# EAGLE design mericiObvod (EAGLE 7.2.0)
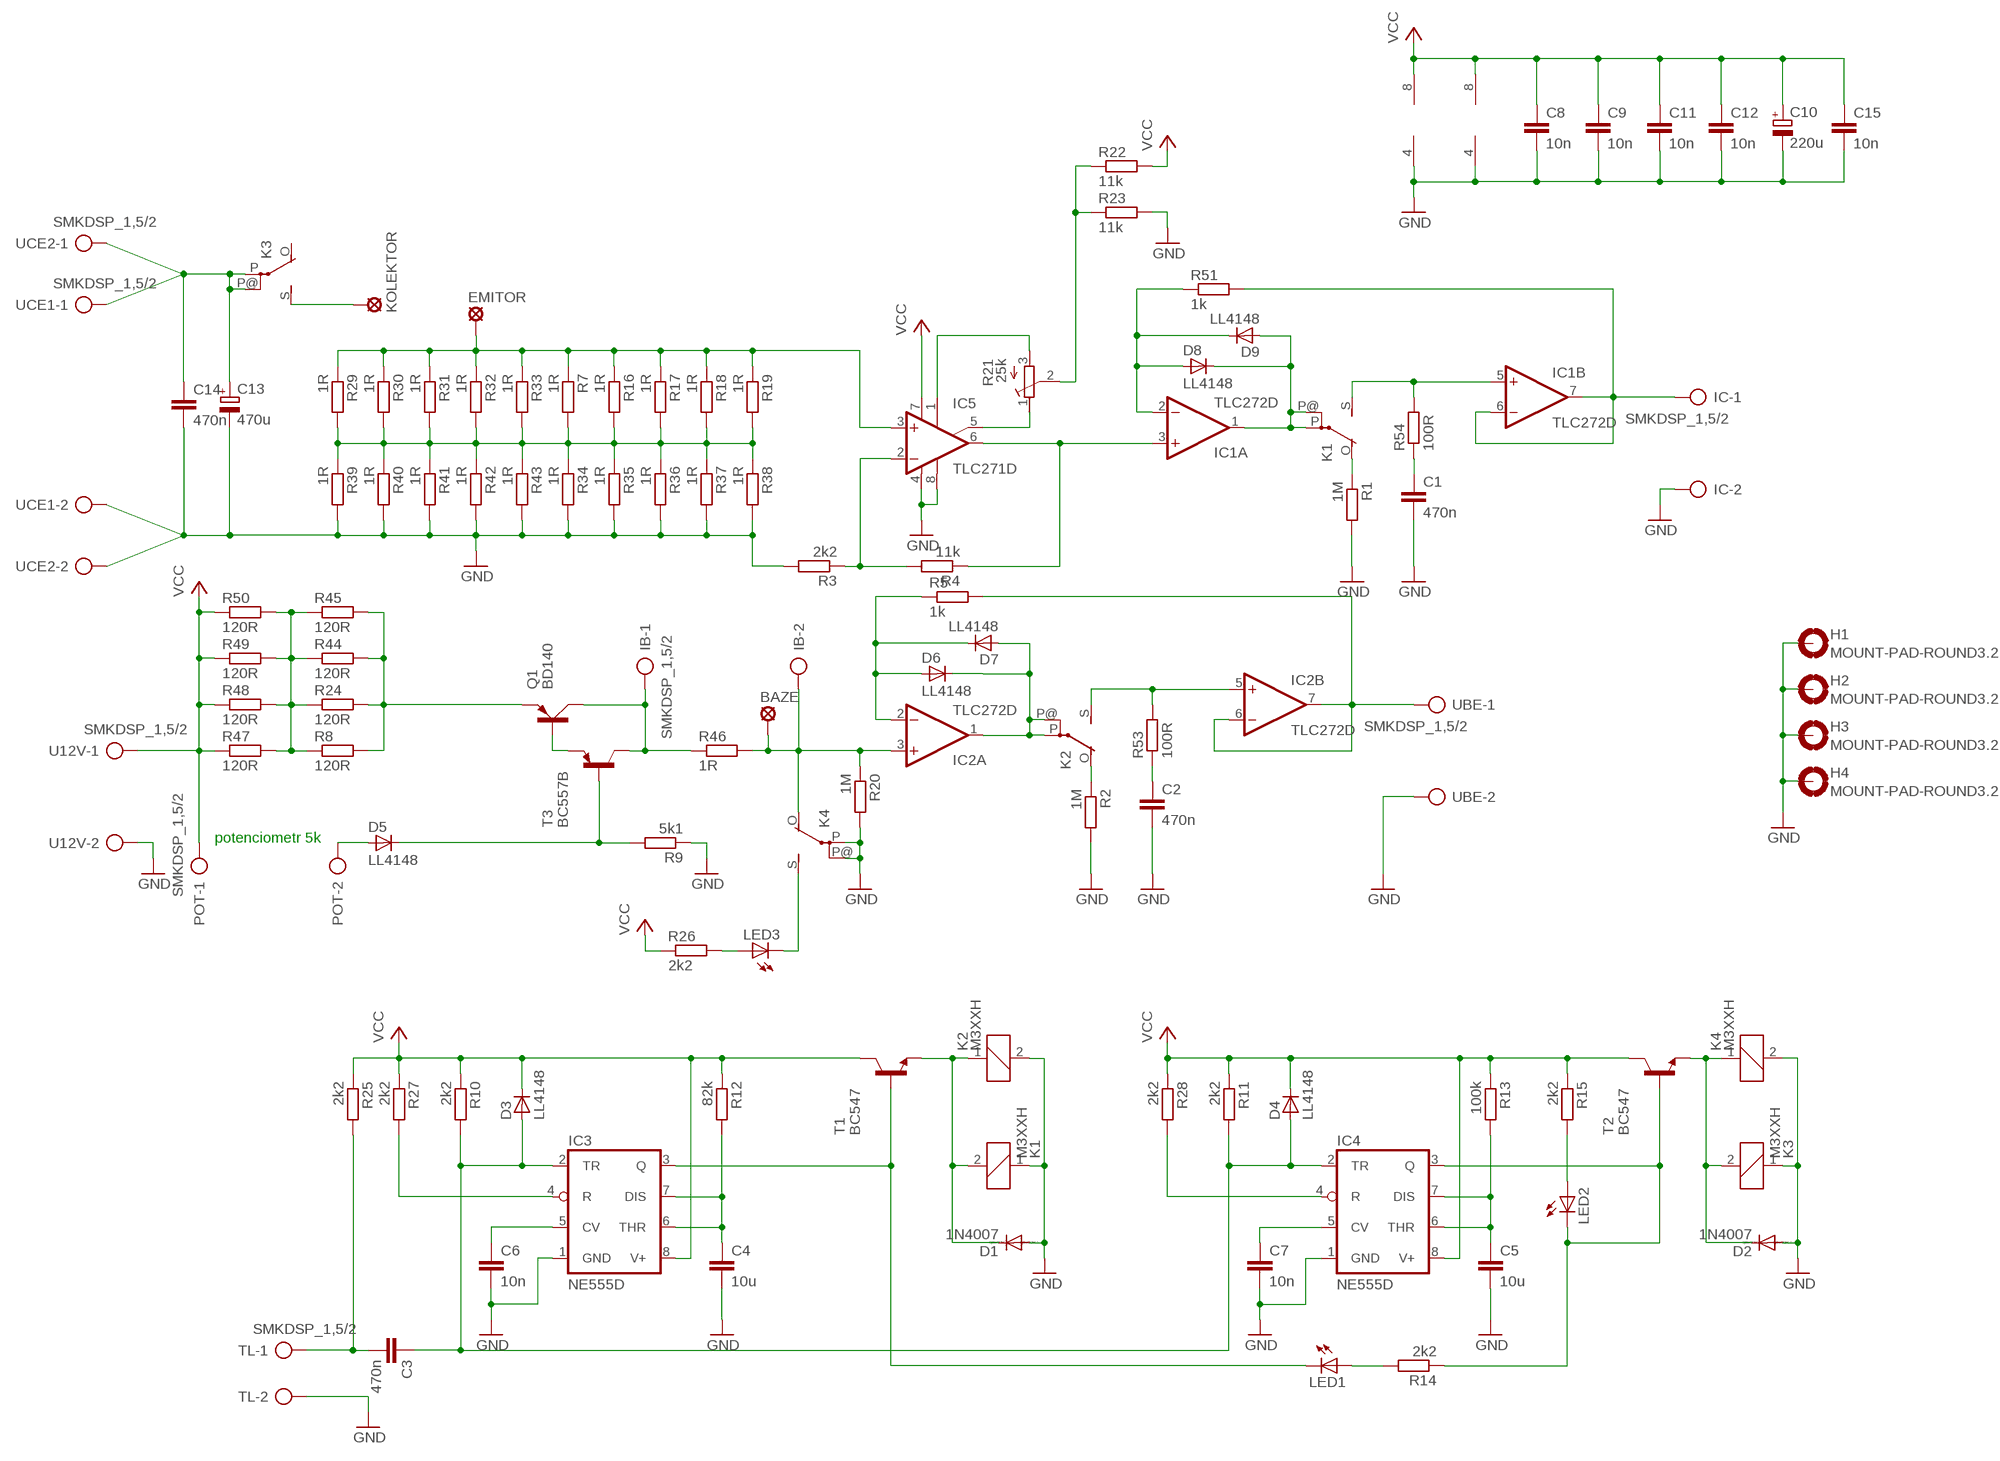
[diagram p0: schematic, sheet 1]

## Parts
BAZE  SE13  [SE13]
C1  470n  C-EUC0805K  [C0805K]
C2  470n  C-EUC0805K  [C0805K]
C3  470n  C-EUC0805K  [C0805K]
C4  10u  C-EUC0805K  [C0805K]
C5  10u  C-EUC0805K  [C0805K]
C6  10n  C-EUC0805K  [C0805K]
C7  10n  C-EUC0805K  [C0805K]
C8  10n  C-EUC0805K  [C0805K]
C9  10n  C-EUC0805K  [C0805K]
C10  220u  CPOL-EUE5-8.5  [E5-8,5]
C11  10n  C-EUC0805K  [C0805K]
C12  10n  C-EUC0805K  [C0805K]
C13  470u  CPOL-EUE5-8.5  [E5-8,5]
C14  470n  C-EU050-030X075  [C050-030X075]
C15  10n  C-EUC0805K  [C0805K]
D1  1N4007  DIODE-DO41-10  [DO41-10]
D2  1N4007  DIODE-DO41-10  [DO41-10]
D3  LL4148  D-SOD-80  [SOD80]
D4  LL4148  D-SOD-80  [SOD80]
D5  LL4148  D-SOD-80  [SOD80]
D6  LL4148  D-SOD-80  [SOD80]
D7  LL4148  D-SOD-80  [SOD80]
D8  LL4148  D-SOD-80  [SOD80]
D9  LL4148  D-SOD-80  [SOD80]
EMITOR  SE13  [SE13]
H1  MOUNT-PAD-ROUND3.2  [3,2-PAD]
H2  MOUNT-PAD-ROUND3.2  [3,2-PAD]
H3  MOUNT-PAD-ROUND3.2  [3,2-PAD]
H4  MOUNT-PAD-ROUND3.2  [3,2-PAD]
IB  SMKDSP_1,5/2  [SMKDSP_1,5/2]
IC  SMKDSP_1,5/2  [SMKDSP_1,5/2]
IC1  TLC272D  [SO08]
IC2  TLC272D  [SO08]
IC3  NE555D  [SO08]
IC4  NE555D  [SO08]
IC5  TLC271D  [SO08]
K1  M3XXH  [M3XXH]
K2  M3XXH  [M3XXH]
K3  M3XXH  [M3XXH]
K4  M3XXH  [M3XXH]
KOLEKTOR  SE13  [SE13]
LED1  LED3MM  [LED3MM]
LED2  LED3MM  [LED3MM]
LED3  LED3MM  [LED3MM]
POT  SMKDSP_1,5/2  [SMKDSP_1,5/2]
Q1  BD140  [TO126AV]
R1  1M  R-EU_R0805  [R0805]
R2  1M  R-EU_R0805  [R0805]
R3  2k2  R-EU_R0805  [R0805]
R4  11k  R-EU_R0805  [R0805]
R5  1k  R-EU_R0805  [R0805]
R7  1R  R-EU_R0805  [R0805]
R8  120R  R-EU_R0805  [R0805]
R9  5k1  R-EU_R0805  [R0805]
R10  2k2  R-EU_R0805  [R0805]
R11  2k2  R-EU_R0805  [R0805]
R12  82k  R-EU_R0805  [R0805]
R13  100k  R-EU_R0805  [R0805]
R14  2k2  R-EU_R0805  [R0805]
R15  2k2  R-EU_R0805  [R0805]
R16  1R  R-EU_R0805  [R0805]
R17  1R  R-EU_R0805  [R0805]
R18  1R  R-EU_R0805  [R0805]
R19  1R  R-EU_R0805  [R0805]
R20  1M  R-EU_R0805  [R0805]
R21  25k  R-TRIMMT18  [RTRIMT18]
R22  11k  R-EU_R0805  [R0805]
R23  11k  R-EU_R0805  [R0805]
R24  120R  R-EU_R0805  [R0805]
R25  2k2  R-EU_R0805  [R0805]
R26  2k2  R-EU_R0805  [R0805]
R27  2k2  R-EU_R0805  [R0805]
R28  2k2  R-EU_R0805  [R0805]
R29  1R  R-EU_R0805  [R0805]
R30  1R  R-EU_R0805  [R0805]
R31  1R  R-EU_R0805  [R0805]
R32  1R  R-EU_R0805  [R0805]
R33  1R  R-EU_R0805  [R0805]
R34  1R  R-EU_R0805  [R0805]
R35  1R  R-EU_R0805  [R0805]
R36  1R  R-EU_R0805  [R0805]
R37  1R  R-EU_R0805  [R0805]
R38  1R  R-EU_R0805  [R0805]
R39  1R  R-EU_R0805  [R0805]
R40  1R  R-EU_R0805  [R0805]
R41  1R  R-EU_R0805  [R0805]
R42  1R  R-EU_R0805  [R0805]
R43  1R  R-EU_R0805  [R0805]
R44  120R  R-EU_R0805  [R0805]
R45  120R  R-EU_R0805  [R0805]
R46  1R  R-EU_R0805  [R0805]
R47  120R  R-EU_R0805  [R0805]
R48  120R  R-EU_R0805  [R0805]
R49  120R  R-EU_R0805  [R0805]
R50  120R  R-EU_R0805  [R0805]
R51  1k  R-EU_R0805  [R0805]
R53  100R  R-EU_R0805  [R0805]
R54  100R  R-EU_R0805  [R0805]
T1  BC547  BC547B-NPN-TO92-CBE  [TO92-CBE]
T2  BC547  BC547B-NPN-TO92-CBE  [TO92-CBE]
T3  BC557B  [TO92-EBC]
TL  SMKDSP_1,5/2  [SMKDSP_1,5/2]
U12V  SMKDSP_1,5/2  [SMKDSP_1,5/2]
UBE  SMKDSP_1,5/2  [SMKDSP_1,5/2]
UCE1  SMKDSP_1,5/2  [SMKDSP_1,5/2]
UCE2  SMKDSP_1,5/2  [SMKDSP_1,5/2]

## Nets
GND: C1.2 C2.2 C4.2 C5.2 C6.2 C7.2 C8.2 C9.2 C10.- C11.2 C12.2 C13.- C14.2 C15.2 D1.A D2.A H1.B3,2(MOUNT) H2.B3,2(MOUNT) H3.B3,2(MOUNT) H4.B3,2(MOUNT) IC1.4(P:V-) IC2.4(P:V-) IC3.1(GND) IC4.1(GND) IC5.4(V-) IC5.8(OPT) IC.2 K1.1 K2.2 K3.1 K4.2 K4.P(2:P) K4.P@(2:P) R1.2 R2.2 R3.2 R9.1 R20.2 R23.2 R34.2 R35.2 R36.2 R37.2 R38.2 R39.2 R40.2 R41.2 R42.2 R43.2 TL.2 U12V.2 UBE.2 UCE1.2 UCE2.2
N$1: IC5.2(-IN) R3.1 R4.2
N$2: IC2.6(B:-IN) IC2.7(B:OUT) R5.2 UBE.1
N$3: C1.1 R54.1
N$4: C2.1 R53.1
N$5: D6.1(C) D7.2(A) IC2.1(A:OUT) K2.P(2:P) K2.P@(2:P)
N$6: D8.1(C) D9.2(A) IC1.1(A:OUT) K1.P(2:P) K1.P@(2:P)
N$7: K2.O(2:O) R2.1
N$8: R7.2 R16.2 R17.2 R18.2 R19.2 R29.2 R30.2 R31.2 R32.2 R33.2 R34.1 R35.1 R36.1 R37.1 R38.1 R39.1 R40.1 R41.1 R42.1 R43.1
N$9: Q1.B T3.E
N$10: IC1.6(B:-IN) IC1.7(B:OUT) IC.1 R51.2
N$11: D6.2(A) D7.1(C) IC2.2(A:-IN) R5.1
N$12: R8.1 R24.1 R44.1 R45.1 R47.2 R48.2 R49.2 R50.2
N$13: BAZE.MP IB.2 IC2.3(A:+IN) K4.O(2:O) R20.1 R46.2
N$14: D5.2(A) POT.2
N$15: D5.1(C) R9.2 T3.B
N$16: IB.1 Q1.C R46.1 T3.C
N$17: Q1.E R8.2 R24.2 R44.2 R45.2
N$18: D1.C K1.2 K2.1 T1.E
N$19: IC3.3(Q) LED1.K(C) T1.B
N$20: IC4.3(Q) LED2.K(C) R14.1 T2.B
N$21: D2.C K3.2 K4.1 T2.E
N$22: C3.1 D3.2(A) D4.2(A) IC3.2(TR) IC4.2(TR) R10.2 R11.2
N$23: LED1.A R14.2
N$24: C5.1 IC4.6(THR) IC4.7(DIS) R13.2
N$25: C4.1 IC3.6(THR) IC3.7(DIS) R12.2
N$26: C6.1 IC3.5(CV)
N$27: IC1.3(A:+IN) IC5.6(OUT) R4.1
N$28: C7.1 IC4.5(CV)
N$29: LED2.A R15.2
N$30: C3.2 R25.2 TL.1
N$31: LED3.A R26.2
N$32: IC5.5(ON2) R21.1(E)
N$33: IC5.1(ON1) R21.3(A)
N$34: R21.2(S) R22.1 R23.1
N$35: K4.S(2:S) LED3.K(C)
N$36: IC3.4(R) R27.2
N$37: IC4.4(R) R28.2
N$38: K1.O(2:O) R1.1
N$39: D8.2(A) D9.1(C) IC1.2(A:-IN) R51.1
N$40: C13.+ C14.1 K3.P(2:P) K3.P@(2:P) UCE1.1 UCE2.1
N$41: IC1.5(B:+IN) K1.S(2:S) R54.2
N$42: IC2.5(B:+IN) K2.S(2:S) R53.2
N$43: EMITOR.MP IC5.3(+IN) R7.1 R16.1 R17.1 R18.1 R19.1 R29.1 R30.1 R31.1 R32.1 R33.1
N$47: K3.S(2:S) KOLEKTOR.MP
VCC: C8.1 C9.1 C10.+ C11.1 C12.1 C15.1 D3.1(C) D4.1(C) IC1.8(P:V+) IC2.8(P:V+) IC3.8(V+) IC4.8(V+) IC5.7(V+) POT.1 R10.1 R11.1 R12.1 R13.1 R15.1 R22.2 R25.1 R26.1 R27.1 R28.1 R47.1 R48.1 R49.1 R50.1 T1.C T2.C U12V.1
Unconnected: K3.O(2:O)

## Notes on the sheet
- potenciometr 5k

## Library data of the parts
BAZE EMITOR KOLEKTOR = solpad:SE13: SOLDER PAD E1542, drill 1,3mm, distributor Buerklin, 07F815
C1-C9 C11 C12 C14 C15 = rcl:C-EU: CAPACITOR, European symbol
C10 C13 = rcl:CPOL-EU: POLARIZED CAPACITOR, European symbol
D1 D2 = diode:DIODE-: DIODE
D3-D9 = semicon-smd-ipc:D-: DIODE unfilled
H1-H4 = holes:MOUNT-PAD-ROUND: MOUNTING PAD, round
IB IC POT TL U12V UBE UCE1 UCE2 = con-phoenix-smkdsp:SMKDSP_1,5/2: Printklemme, Nennstrom: 17,5 A, Bemessungsspannung: 250 V, Raster: 5,0 mm Source: http://eshop.phoenixcontact.de .. 1733415.pdf; MF: FARNELL; MPN: 1733570; OC_FARNELL: 3041244; OC_NEWARK: 69C8588
IC1 IC2 = linear:TLC272: OP AMP
IC3 IC4 = linear:*555: TIMER
IC5 = linear:TLC271: OP AMP
K1-K4 = relay:M3XXH: RELAY 1 x switch; OC_FARNELL: unknown; OC_NEWARK: unknown
LED1-LED3 = led:LED: LED OSRAM: - CHIPLED LG R971, LG N971, LY N971, LG Q971, LY Q971, LO R971, LY R971 LH N974, LH R974 LS Q976, LO Q976, LY Q976 LO Q996 - Hyper CHIPLED LW Q18S LB Q993, LB Q99A, LB R99A - SideLED LS A670, LO A670, LY A670, LG A670, LP A670 LB A673, LV A673, LT A673, LW A673 LH A674 LY A675 LS A676, LA A676, LO A676, LY A676, LW A676 LS A679, LY A679, LG A679 - Hyper Micro SIDELED® LS Y876, LA Y876, LO Y876, LY Y876 LT Y87S - SmartLED LW L88C, LW L88S LB L89C, LB L89S, LG L890 LS L89K, LO L89K, LY L89K LS L896, LA L896, LO L896, LY L896 - TOPLED LS T670, LO T670, LY T670, LG T670, LP T670 LSG T670, LSP T670, LSY T670, LOP T670, LYG T670 LG T671, LOG T671, LSG T671 LB T673, LV T673, LT T673, LW T673 LH T674 LS T676, LA T676, LO T676, LY T676, LB T676, LH T676, LSB T676, LW T676 LB T67C, LV T67C, LT T67C, LS T67K, LO T67K, LY T67K, LW E67C LS E67B, LA E67B, LO E67B, LY E67B, LB E67C, LV E67C, LT E67C LW T67C LS T679, LY T679, LG T679 LS T770, LO T770, LY T770, LG T770, LP T770 LB T773, LV T773, LT T773, LW T773 LH T774 LS E675, LA E675, LY E675, LS T675 LS T776, LA T776, LO T776, LY T776, LB T776 LHGB T686 LT T68C, LB T68C - Hyper Mini TOPLED® LB M676 - Mini TOPLED Santana® LG M470 LS M47K, LO M47K, LY M47K Source: http://www.osram.convergy.de LUXEON: - LUMILED® LXK2-PW12-R00, LXK2-PW12-S00, LXK2-PW14-U00, LXK2-PW14-V00 LXK2-PM12-R00, LXK2-PM12-S00, LXK2-PM14-U00 LXK2-PE12-Q00, LXK2-PE12-R00, LXK2-PE12-S00, LXK2-PE14-T00, LXK2-PE14-U00 LXK2-PB12-K00, LXK2-PB12-L00, LXK2-PB12-M00, LXK2-PB14-N00, LXK2-PB14-P00, LXK2-PB14-Q00 LXK2-PR12-L00, LXK2-PR12-M00, LXK2-PR14-Q00, LXK2-PR14-R00 LXK2-PD12-Q00, LXK2-PD12-R00, LXK2-PD12-S00 LXK2-PH12-R00, LXK2-PH12-S00 LXK2-PL12-P00, LXK2-PL12-Q00, LXK2-PL12-R00 Source: www.luxeon.com KINGBRIGHT: KA-3528ASYC Source: www.kingbright.com
Q1 = transistor-power:BD140: PNP TRANSISTOR
R1-R5 R7-R20 R22-R51 R53 R54 = rcl:R-EU_: RESISTOR, European symbol
R21 = rcl:R-TRIMM: Trimm resistor
T1 T2 = transistor:*-NPN-: NPN Transistror BF959 corrected 2008.03.06
T3 = transistor-pnp:BC557*: PNP Transistror

## Board
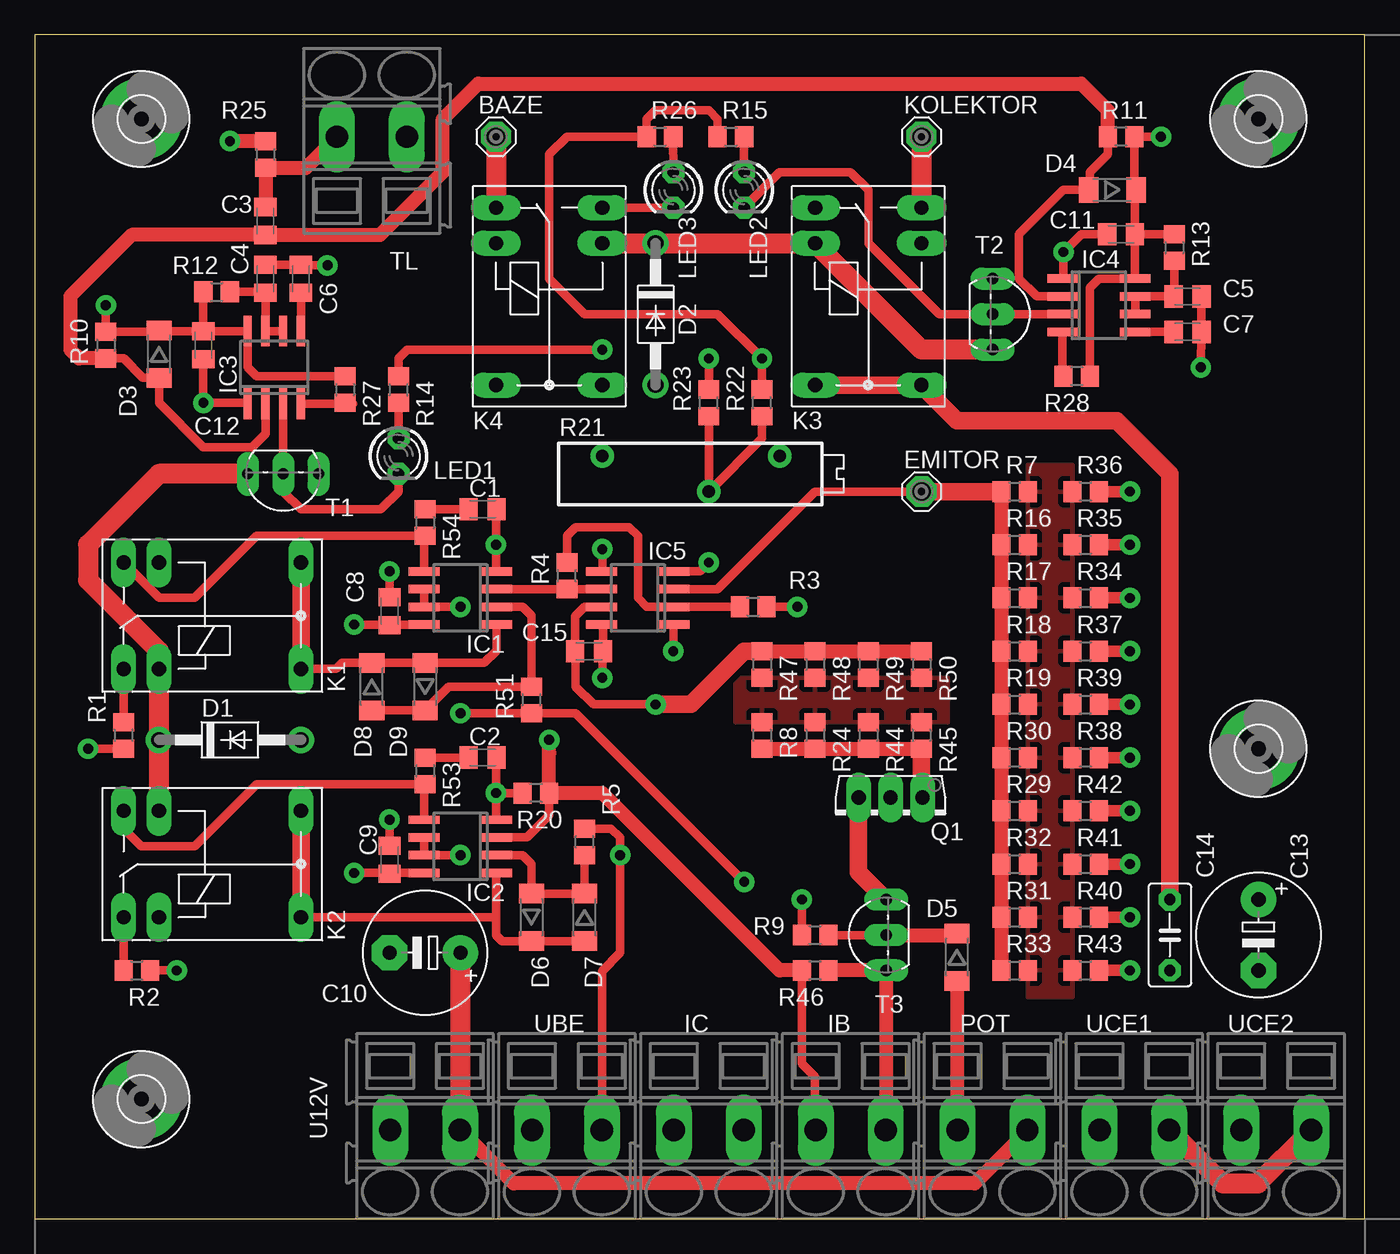
[diagram p1: board, top side]
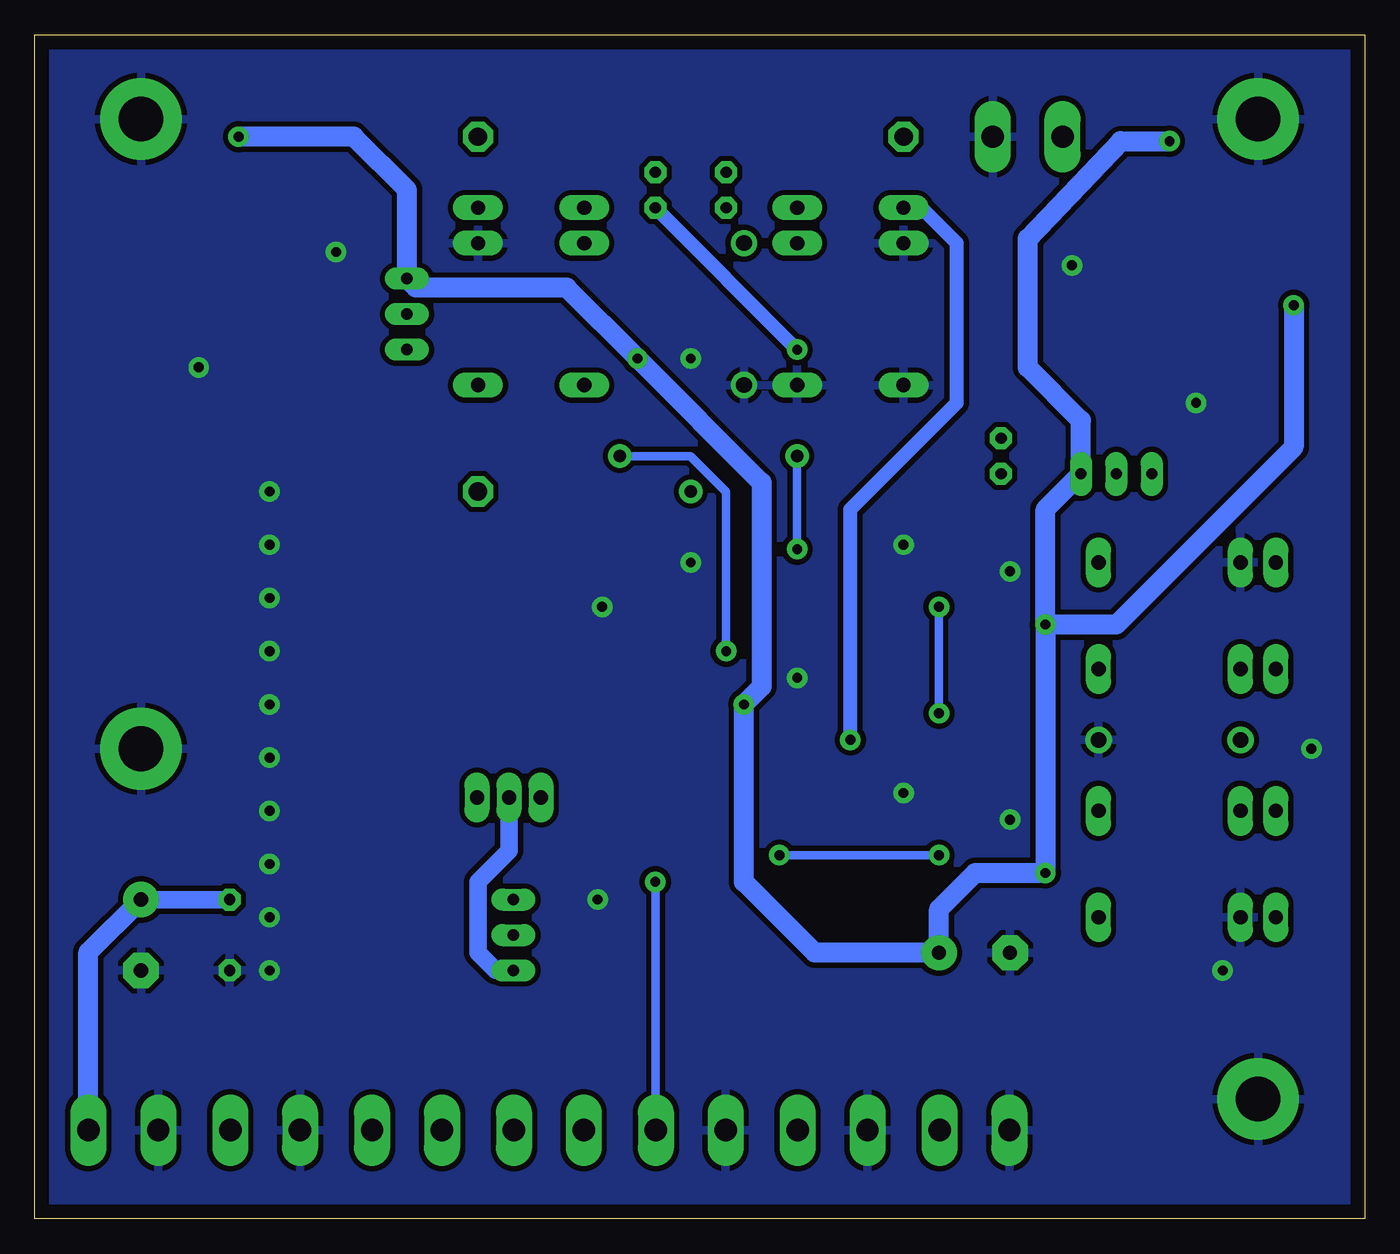
[diagram p2: board, bottom side, seen from below]

Size 95.23 x 84.76 mm. Coordinates in mm from the lower left corner, seen from the top.
Outline: 0,0 95.23,0 95.23,84.76 0,84.76 0,0
Copper layers (1*16): Top 0.035mm / dielectric 0.14mm / Bottom 0.035mm
Design rules "rules": minimum track width 10mil, minimum drill 24mil, track to track 15mil, track to pad 15mil, pad to pad 10mil, via to via 10mil, smd to smd 10mil, copper to edge 40mil, drill to drill 8mil, minimum pad ring 15mil, minimum via ring 15mil, stop-mask expansion 4mil, vias tented up to drill 0mil, thermal gap 15mil

### Footprints (pad centres in the part's own frame; a part is rotated, then mirrored left to right if it is on the bottom)
SE13 = drill 1.321 pad 2.159 octagon: MP 0,0
C0805K = smd 1.3 x 1.6: 1 -1,0; 2 1,0
E5-8,5 = drill 1.016 pad 2.54: + -2.54,0 | drill 1.016 pad 2.54 octagon: - 2.54,0
C050-030X075 = drill 0.813 octagon: 1 -2.54,0; 2 2.54,0
DO41-10 = drill 1.118: A 5.08,0; C -5.08,0
SOD80 = smd 1.4 x 1.8: 1 -1.7,0; 2 1.7,0
3,2-PAD = drill 3.2 pad 5.842: B3,2 0,0
SMKDSP_1,5/2 = drill 1.6 pad 1.8 long: 1 -2.5,0; 2 2.5,0
SO08 = smd 0.6 x 2.2: 1 -1.905,-2.6; 2 -0.635,-2.6; 3 0.635,-2.6; 4 1.905,-2.6; 5 1.905,2.6; 6 0.635,2.6; 7 -0.635,2.6; 8 -1.905,2.6
M3XXH = drill 1.016 long: 1 -3.81,3.81; 2 -3.81,-3.81; O -6.35,-3.81; P 6.35,-3.81; P@ 6.35,3.81; S -6.35,3.81
LED3MM = drill 0.813 octagon: A -1.27,0; K 1.27,0
TO126AV = drill 1.016 long: B 2.286,-1.27; C 0,-1.27; E -2.286,-1.27
R0805 = smd 1.3 x 1.5: 1 -0.95,0; 2 0.95,0
RTRIMT18 = drill 0.9: 1 -7.62,1.27; 2 0,-1.27; 3 5.08,1.27
TO92-CBE = drill 0.813 long: B 0,0; C -2.54,0; E 2.54,0
TO92-EBC = drill 0.813 long: B 0,-1.27; C -2.54,-1.27; E 2.54,-1.27

### Placement (x,y rotation side)
BAZE  33.02,77.47 0 top
C1  32.07,50.8 0 top
C2  32.07,33.02 0 top
C3  16.51,71.44 90 top
C4  16.51,67.31 90 top
C5  82.55,66.04 0 top
C6  19.05,67.31 90 top
C7  82.55,63.5 0 top
C8  25.4,43.5 90 top
C9  25.4,25.72 90 top
C10  27.94,19.05 180 top
C11  77.79,70.48 180 top
C12  12.06,62.55 270 top
C13  87.63,20.32 270 top
C14  81.28,20.32 270 top
C15  39.69,40.64 0 top
D1  13.97,34.29 0 top
D2  44.45,64.77 270 top
D3  8.89,61.91 270 top
D4  77.15,73.66 180 top
D5  66.04,18.73 270 top
D6  35.56,21.59 90 top
D7  39.37,21.59 270 top
D8  24.13,38.1 270 top
D9  27.94,38.1 90 top
EMITOR  63.5,52.07 0 top
H1  7.62,8.57 0 top
H2  7.62,78.74 0 top
H3  87.63,78.74 0 top
H4  87.63,33.66 0 top
IB  58.42,6.35 180 top
IC  48.26,6.35 180 top
IC1  30.48,44.45 90 top
IC2  30.48,26.67 90 top
IC3  17.14,60.96 0 top
IC4  76.2,65.41 270 top
IC5  43.18,44.45 90 top
K1  12.7,43.18 0 top
K2  12.7,25.4 0 top
K3  59.69,66.04 270 top
K4  36.83,66.04 270 top
KOLEKTOR  63.5,77.47 0 top
LED1  26.04,54.61 270 top
LED2  50.8,73.66 270 top
LED3  45.72,73.66 270 top
POT  68.58,6.35 180 top
Q1  61.28,28.89 180 top
R1  6.35,34.61 270 top
R2  7.3,17.78 0 top
R3  51.44,43.81 0 top
R4  38.1,46.04 90 top
R5  39.37,26.99 90 top
R7  70.17,52.07 0 top
R8  52.07,34.61 270 top
R9  55.88,20.32 0 top
R10  5.08,62.55 270 top
R11  77.79,77.47 180 top
R12  13.02,66.36 0 top
R13  81.6,69.53 270 top
R14  26.04,59.37 270 top
R15  49.85,77.47 0 top
R16  70.17,48.26 0 top
R17  70.17,44.45 0 top
R18  70.17,40.64 0 top
R19  70.17,36.83 0 top
R20  35.88,30.48 180 top
R21  48.26,53.34 0 top
R22  52.07,58.42 90 top
R23  48.26,58.42 90 top
R24  55.88,34.61 270 top
R25  16.51,76.2 270 top
R26  44.77,77.47 0 top
R27  22.23,59.37 270 top
R28  74.61,60.33 180 top
R29  70.17,29.21 0 top
R30  70.17,33.02 0 top
R31  70.17,21.59 0 top
R32  70.17,25.4 0 top
R33  70.17,17.78 0 top
R34  75.25,44.45 0 top
R35  75.25,48.26 0 top
R36  75.25,52.07 0 top
R37  75.25,40.64 0 top
R38  75.25,33.02 0 top
R39  75.25,36.83 0 top
R40  75.25,21.59 0 top
R41  75.25,25.4 0 top
R42  75.25,29.21 0 top
R43  75.25,17.78 0 top
R44  59.69,34.61 270 top
R45  63.5,34.61 270 top
R46  55.88,17.78 180 top
R47  52.07,39.69 270 top
R48  55.88,39.69 270 top
R49  59.69,39.69 270 top
R50  63.5,39.69 270 top
R51  35.56,37.15 270 top
R53  27.94,32.07 270 top
R54  27.94,49.85 270 top
T1  17.78,53.34 180 top
T2  68.58,64.77 270 top
T3  59.69,20.32 90 top
TL  24.13,77.47 0 top
U12V  27.94,6.35 180 top
UBE  38.1,6.35 180 top
UCE1  78.74,6.35 180 top
UCE2  88.9,6.35 180 top

### Tracks (layer width: path | path; a pad name or v marks a point on that pad's centre or on a via)
GND  (via drill 0.7)
  Top 0.61: R23.2 v48.26,61.59 | IC5.8 40.69,42.44 C15.2 40.64,40.59 v40.64,38.73 | v33.02,30.48 33.02,28.64 IC2.4 | C9.2 v25.4,28.57 | C8.2 v25.4,46.35 | IC4.1 73.66,67.37 v73.66,69.22 74.93,70.48 C11.2 | v83.5,60.96 C7.2 C5.2 | R1.2 v3.81,33.66 | R2.2 v10.16,17.78 | C12.2 v12.06,58.42 15.18,58.42 IC3.1 | v20.95,68.26 19.1,68.26 C6.2 C4.2 | v54.93,22.86 R9.1 | IC1.4 33.02,46.41 v33.02,48.26 33.02,50.44 C1.2 | v33.02,30.48 33.02,32.97 C2.2 | R20.2 v33.02,30.48 | R3.2 v54.61,43.81 | IC5.4 47.62,46.35 v48.26,46.99
  Top 0.813: R36.2 v78.42,52.07 | R35.2 v78.42,48.26 | R34.2 v78.42,44.45 | R37.2 v78.42,40.64 | R39.2 v78.42,36.83 | R38.2 v78.42,33.02 | R42.2 v78.42,29.21 | R41.2 v78.42,25.4 | R40.2 v78.42,21.59 | R43.2 v78.42,17.78
  pour Bottom: 0,83.82 0,1.27 95.25,1.27 95.25,83.82
N$1
  Top 0.61: R3.1 IC5.2 43.81,43.81 43.18,44.45 43.18,48.9 42.55,49.53 38.73,49.53 38.1,48.9 R4.2
N$2  (via drill 0.7)
  Top 0.61: IC2.6 IC2.7 v30.48,26.04 | R5.2 41.27,27.94 41.91,27.3 v41.91,26.04 41.91,19.05 40.6,17.74 UBE.1
  Bottom 0.61: v30.48,26.04 v41.91,26.04
N$3
  Top 0.61: C1.1 R54.1
N$4
  Top 0.61: C2.1 R53.1
N$5
  Top 0.61: 33.02,21.59 33.02,20.32 33.45,19.89 D6.1 D7.2 | 33.02,21.59 33.02,24.7 IC2.1 | 33.02,21.59 K2.P
  Top 1.27: K2.P K2.P@
N$6
  Top 0.61: K1.P 21.59,39.37 22.02,39.8 D8.1 D9.2 32.18,39.8 33.02,40.64 33.08,40.7 IC1.1
  Top 1.27: K1.P K1.P@
N$7
  Top 0.61: R2.1 K2.O
N$8
  pour Top: 74.3,53.98 71.12,53.98 71.12,15.88 74.3,15.88
N$9
  Top 1.27: Q1.B 58.99,24.83 T3.E
N$10  (via drill 0.7)
  Top 0.61: IC1.6 IC1.7 v30.48,43.81 | v50.8,24.13 38.73,36.2 R51.2 v30.48,36.2
  Bottom 0.61: v50.8,24.13 50.8,6.39 IC.1 | v30.48,36.2 v30.48,43.81
N$11
  Top 0.61: R5.1 D7.1 D6.2 35.56,25.4 34.92,26.04 IC2.2
N$12
  pour Top: 50.16,35.56 50.16,38.73 65.41,38.73 65.41,35.56
N$13  (via drill 0.7)
  Top 0.61: R46.2 54.93,11.11 55.88,10.16 55.88,6.39 IB.2 | R20.1 36.83,28.89 35.24,27.3 IC2.3
  Top 1.016: R46.2 53.34,17.78 40.64,30.48 R20.1 36.83,33.34 v36.83,34.29
  Top 1.422: BAZE.MP K4.O
  Bottom 1.016: v36.83,34.29 36.83,50.8 29.21,58.42 29.21,69.85 31.75,72.39 K4.O
N$14
  Top 1.016: POT.2 66.08,16.99 D5.2
N$15
  Top 0.61: T3.B R9.2
  Top 1.016: T3.B 65.93,20.32 D5.1
N$16
  Top 0.61: 60.96,6.39 IB.1
  Top 1.016: R46.1 T3.C 60.96,6.39
  Bottom 1.27: Q1.C 61.28,26.35 63.5,24.13 63.5,19.05 62.23,17.78 T3.C
N$17
  Top 1.016: R8.2 R24.2 R44.2 R45.2
  Top 1.27: R45.2 63.5,30.23 Q1.E
N$18
  Top 1.422: K2.1 D1.C K1.2 8.89,40.64 3.81,45.72 3.81,48.26 8.89,53.34 T1.E
N$19
  Top 0.61: IC3.3 T1.B 17.78,52.07 19.05,50.8 24.77,50.8 26.04,52.07 LED1.K
N$20  (via drill 0.7)
  Top 0.61: IC4.3 T2.B 64.77,64.77 59.69,69.85 59.69,73.66 58.42,74.93 53.34,74.93 LED2.K | R14.1 26.04,61.59 26.67,62.23 v40.64,62.23
  Bottom 1.016: v40.64,62.23 LED2.K
N$21
  Top 1.422: K4.1 D2.C K3.2 63.5,62.23 T2.E
N$22
  Top 0.61: IC4.2 71.75,66.04 70.48,67.31 70.48,70.48 73.66,73.66 D4.2 75.56,73.77 75.56,74.93 76.84,76.2 R11.2 | IC3.2 16.51,56.2 15.56,55.24 12.06,55.24 8.89,58.42 D3.2 7.73,60.21 6.35,61.6 R10.2
  Top 1.016: R11.2 76.84,79.37 74.93,81.28 31.75,81.28 29.21,78.74 29.21,74.93 24.72,70.44 C3.1 6.94,70.44 2.54,66.04 2.54,62.23 3.17,61.6 R10.2
N$23
  Top 0.61: R14.2 LED1.A
N$24
  Top 0.61: IC4.6 IC4.7 C5.1 81.6,66.09 R13.2
N$25
  Top 0.61: R12.2 16.46,66.36 C4.1 IC3.7 IC3.6
N$26
  Top 0.61: C6.1 IC3.5
N$27
  Top 0.61: IC5.6 R4.1 IC1.3
N$28
  Top 0.61: IC4.5 C7.1
N$29
  Top 0.61: LED2.A R15.2
N$30
  Top 1.016: TL.1 19.41,75.25 R25.2 C3.2
N$31
  Top 0.61: R26.2 LED3.A
N$32  (via drill 0.7)
  Top 0.61: v40.64,47.94 40.64,46.41 IC5.5
  Bottom 0.61: v40.64,47.94 R21.1
N$33  (via drill 0.7)
  Top 0.61: v45.72,40.64 45.72,42.48 IC5.1
  Bottom 0.61: v45.72,40.64 45.72,52.07 48.26,54.61 R21.3
N$34
  Top 0.61: R23.1 R21.2 52.07,55.88 R22.1
N$35
  Top 0.61: K4.S LED3.K
N$36
  Top 0.61: IC3.4 22.8,58.36 R27.2
N$37
  Top 0.61: IC4.4 73.6,61.02 R28.2
N$38
  Top 0.61: K1.O 6.35,36.83 R1.1
N$39
  Top 0.61: IC1.2 34.92,43.81 35.56,43.18 R51.1 29.64,38.1 D9.1 D8.2
N$40
  Top 1.27: C14.1 81.28,53.34 77.47,57.15 66.04,57.15 K3.P@ K3.P
  Top 1.422: 81.28,6.35 85.09,2.54 87.59,2.54 UCE2.1
  Top 1.676: UCE1.1 81.28,6.35
  Bottom 1.27: C13.+ C14.1
  Bottom 1.422: UCE2.1 91.4,19.09 C13.+
N$41
  Top 0.61: IC1.5 27.88,48.52 R54.2 15.88,48.9 11.43,44.45 8.89,44.45 K1.S
N$42
  Top 0.61: K2.S 6.35,27.94 7.62,26.67 11.43,26.67 15.88,31.12 R53.2 27.88,31.06 IC2.5
N$43
  Top 0.61: EMITOR.MP 58.42,52.07 55.88,52.07 48.9,45.09 IC5.3
  Top 1.016: R7.1 R16.1 R17.1 R18.1 R19.1 R30.1 R29.1 R32.1 R31.1 R33.1
  Top 1.27: EMITOR.MP R7.1
N$47
  Top 1.422: KOLEKTOR.MP K3.S
VCC  (via drill 0.7)
  Top 0.61: R22.2 v52.07,61.59 48.9,64.77 39.37,64.77 36.83,67.31 36.83,76.2 38.1,77.47 R26.1 | IC5.7 39.37,43.81 38.69,43.13 C15.1 38.73,40.59 38.73,38.1 40.01,36.83 v44.45,36.83 | R47.1 | v22.86,42.55 25.35,42.55 C8.1 25.45,42.55 IC1.8 | v22.86,24.77 25.35,24.77 C9.1 25.45,24.77 IC2.8 | C11.1 78.79,67.32 IC4.8 76.2,67.31 75.56,66.67 R28.1 | C11.1 R13.1 | C11.1 78.79,73.59 D4.1 78.74,73.78 R11.1 v80.64,77.47 | R27.1 15.88,60.32 15.24,60.96 IC3.8 12.08,63.56 C12.1 | v5.08,65.41 R10.1 8.78,63.5 D3.1 8.96,63.55 C12.1 | C12.1 12.06,66.04 R12.1 | R15.1 48.9,78.74 48.26,79.38 44.45,79.38 43.81,78.74 R26.1
  Top 1.016: R47.1 R48.1 R49.1 R50.1 | R25.1 v13.97,77.15 | POT.1 71.08,6.31 67.31,2.54 34.29,2.54 30.48,6.35 U12V.1 | R26.1
  Top 1.27: R47.1 50.8,40.64 46.99,36.83 v44.45,36.83
  Top 1.422: 30.48,6.35 C10.+
  Bottom 1.422: v22.86,42.55 v22.86,24.77 IC2.8 30.48,22.16 C10.+ 39.37,19.05 44.45,24.13 v44.45,36.83 43.18,38.1 43.18,52.7 v52.07,61.59 57.15,66.67 67.94,66.67 T2.C 68.58,73.66 72.39,77.47 v80.64,77.47 | v22.86,42.55 22.86,50.8 T1.C 20.32,57.15 24.13,60.96 24.13,70.17 17.46,77.15 v13.97,77.15 | v5.08,65.41 5.08,55.24 17.78,42.55 v22.86,42.55

### Text on the board
tDocu: POZOR: / 12 V zdroj musi byt galvanicky oddeleny od zdroje UCE